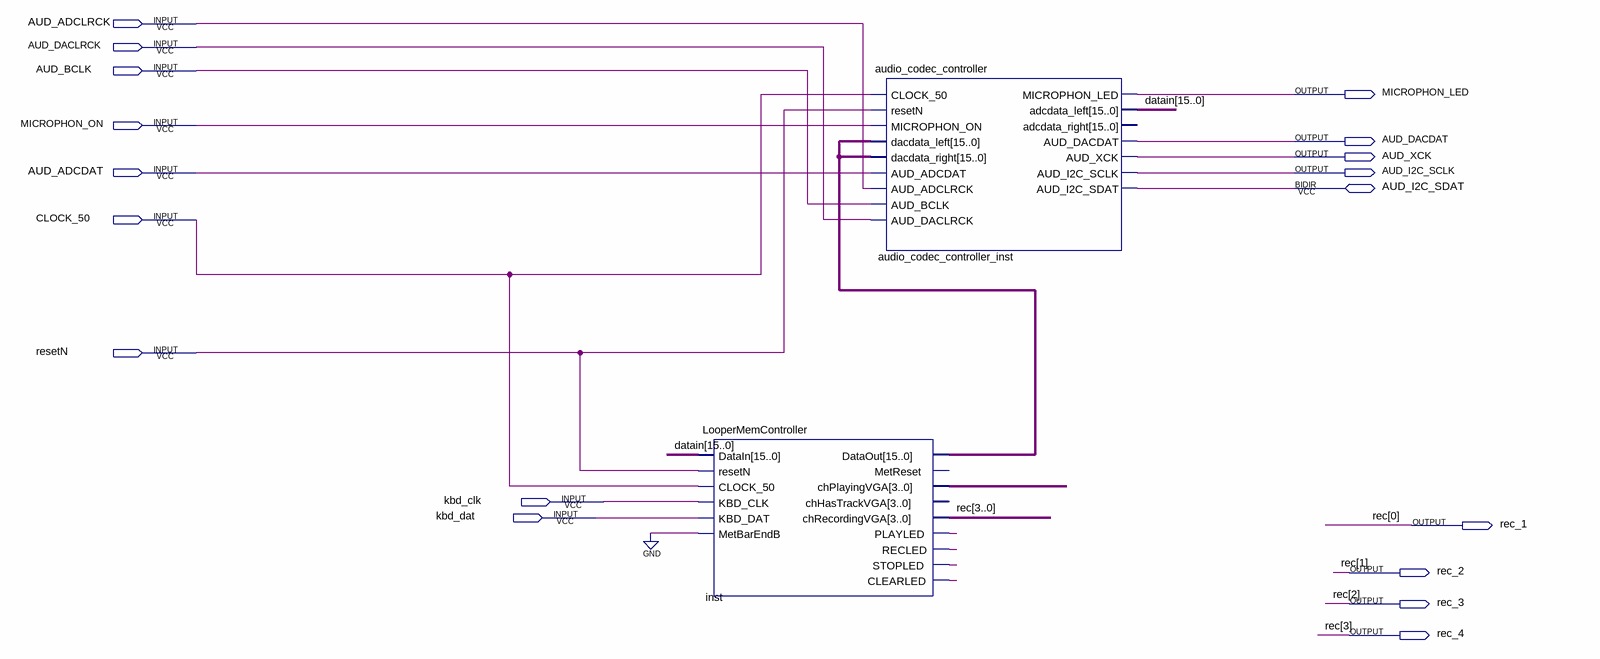
[diagram p0: schematic sheet]
// Quartus schematic test.bdf as structural Verilog: 2 symbols, 18 pins
module test (
  input  AUD_ADCLRCK,
  input  AUD_DACLRCK,
  input  AUD_BCLK,
  input  MICROPHON_ON,
  input  AUD_ADCDAT,
  input  CLOCK_50,
  input  resetN,
  input  kbd_clk,
  input  kbd_dat,
  inout  AUD_I2C_SDAT,
  output MICROPHON_LED,
  output AUD_DACDAT,
  output AUD_XCK,
  output AUD_I2C_SCLK,
  output rec_1,
  output rec_2,
  output rec_3,
  output rec_4
);

  wire inst_clearled, inst_playled, inst_recled, inst_stopled;
  wire [3:0] inst_chplayingvga;
  wire [15:0] datain, inst_dataout;

  LooperMemController inst (
    .DataIn(datain), .resetN(resetN), .CLOCK_50(CLOCK_50), .KBD_CLK(kbd_clk), .KBD_DAT(kbd_dat),
    .MetBarEndB(1'b0), .DataOut(inst_dataout), .chPlayingVGA(inst_chplayingvga),
    .chRecordingVGA({rec_4, rec_3, rec_2, rec_1}), .PLAYLED(inst_playled), .RECLED(inst_recled),
    .STOPLED(inst_stopled), .CLEARLED(inst_clearled));  // open: MetReset, chHasTrackVGA
  audio_codec_controller audio_codec_controller_inst (
    .CLOCK_50(CLOCK_50), .resetN(resetN), .MICROPHON_ON(MICROPHON_ON), .dacdata_left(inst_dataout),
    .dacdata_right(inst_dataout), .AUD_ADCDAT(AUD_ADCDAT), .AUD_ADCLRCK(AUD_ADCLRCK), .AUD_BCLK(AUD_BCLK),
    .AUD_DACLRCK(AUD_DACLRCK), .MICROPHON_LED(MICROPHON_LED), .adcdata_left(datain), .AUD_DACDAT(AUD_DACDAT),
    .AUD_XCK(AUD_XCK), .AUD_I2C_SCLK(AUD_I2C_SCLK), .AUD_I2C_SDAT(AUD_I2C_SDAT));  // open: adcdata_right

  // Other names for the same wires on the sheet: rec[3:0] = {rec_4, rec_3, rec_2, rec_1}
endmodule
